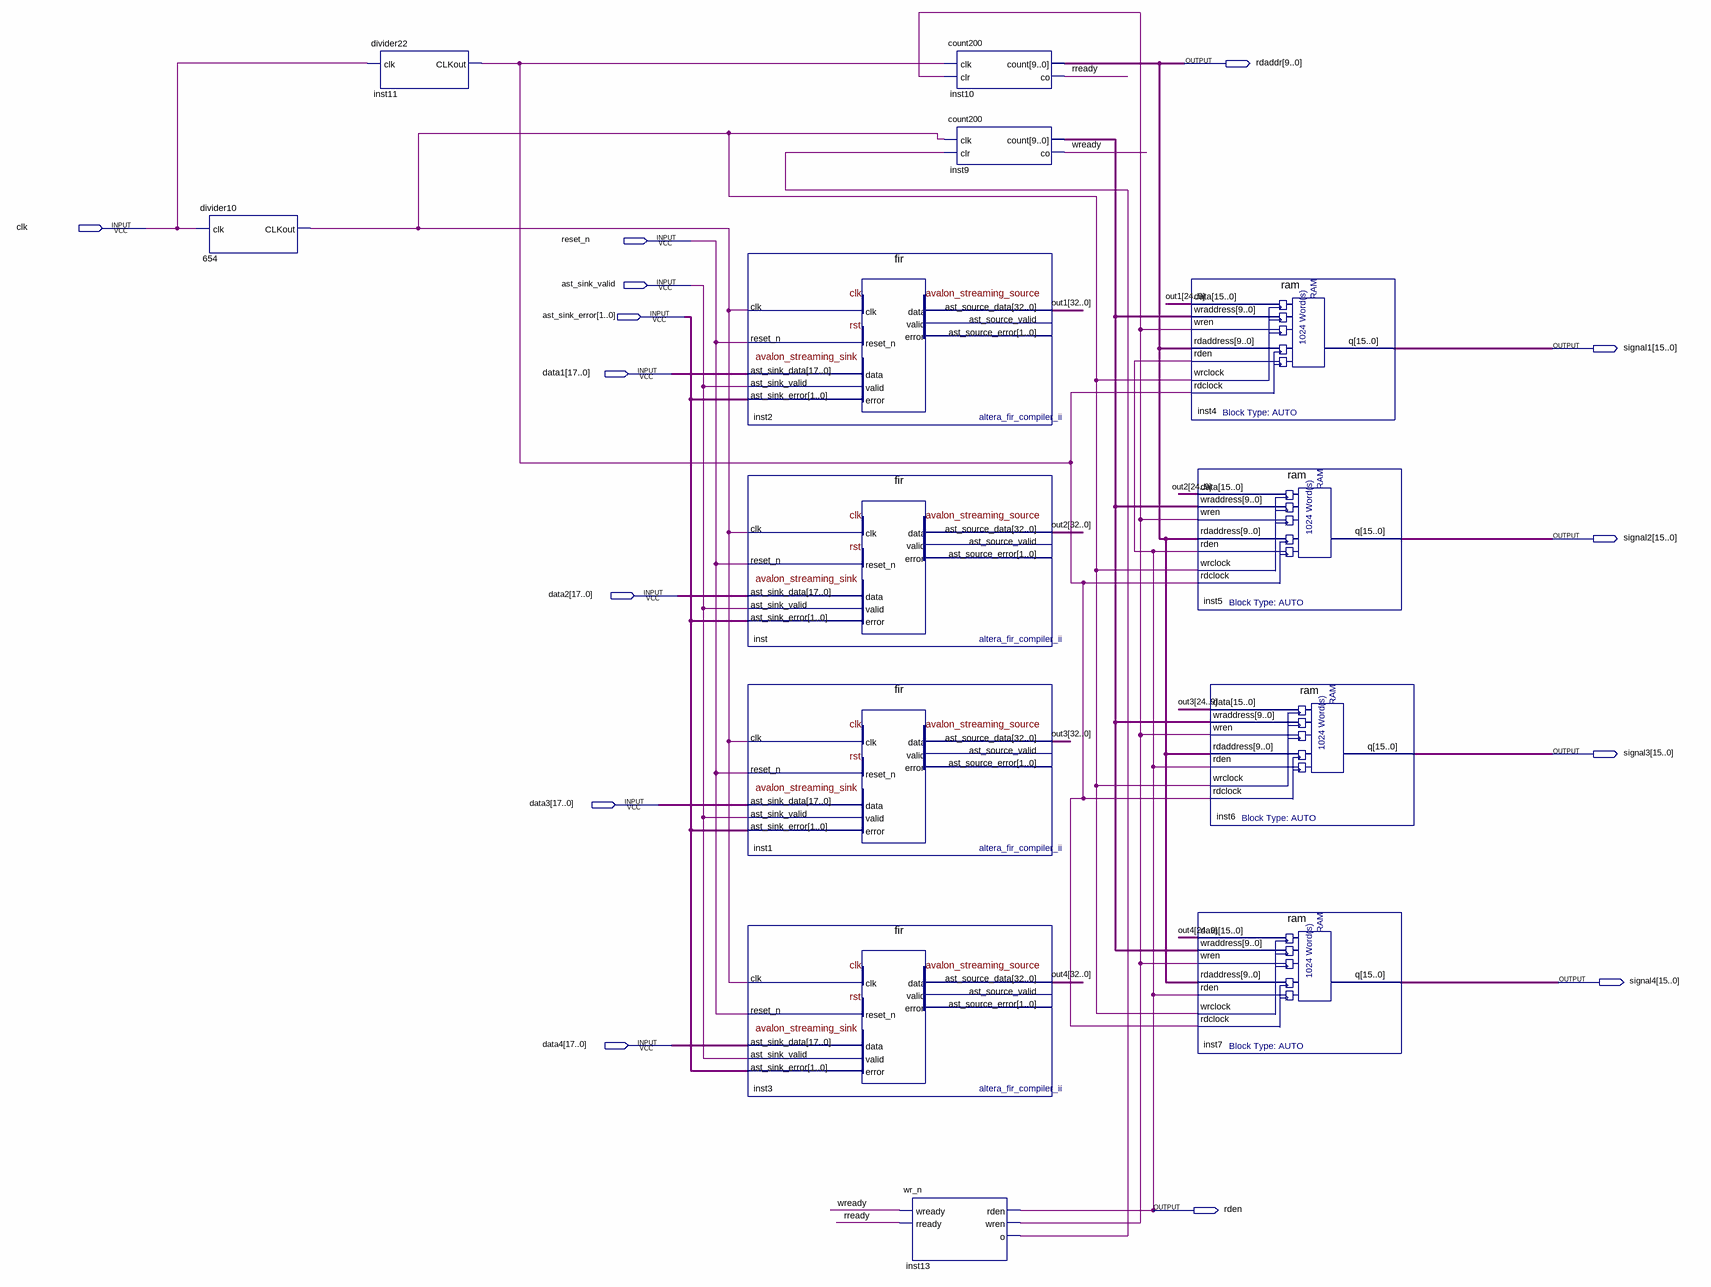
[diagram p0: schematic sheet]
// Quartus schematic dataa_b.bdf as structural Verilog: 13 symbols, 14 pins
module dataa_b (
  input  clk,
  input  reset_n,
  input  ast_sink_valid,
  input  [1:0] ast_sink_error,
  input  [17:0] data1,
  input  [17:0] data2,
  input  [17:0] data3,
  input  [17:0] data4,
  output [9:0] rdaddr,
  output [15:0] signal1,
  output [15:0] signal2,
  output [15:0] signal3,
  output [15:0] signal4,
  output rden
);

  wire inst11_clkout, inst13_o, inst13_wren, n654_clkout, rready, wready;
  wire [9:0] inst9_count;
  wire [32:0] out1, out2, out3, out4;

  divider10 u_654 (.clk(clk), .CLKout(n654_clkout));
  divider22 inst11 (.clk(clk), .CLKout(inst11_clkout));
  fir inst2 (
    .clk(n654_clkout), .reset_n(reset_n), .ast_sink_data(data1), .ast_sink_valid(ast_sink_valid),
    .ast_sink_error(ast_sink_error), .ast_source_data(out1));  // open: ast_source_valid, ast_source_error
  fir inst (
    .clk(n654_clkout), .reset_n(reset_n), .ast_sink_data(data2), .ast_sink_valid(ast_sink_valid),
    .ast_sink_error(ast_sink_error), .ast_source_data(out2));  // open: ast_source_valid, ast_source_error
  fir inst1 (
    .clk(n654_clkout), .reset_n(reset_n), .ast_sink_data(data3), .ast_sink_valid(ast_sink_valid),
    .ast_sink_error(ast_sink_error), .ast_source_data(out3));  // open: ast_source_valid, ast_source_error
  fir inst3 (
    .clk(n654_clkout), .reset_n(reset_n), .ast_sink_data(data4), .ast_sink_valid(ast_sink_valid),
    .ast_sink_error(ast_sink_error), .ast_source_data(out4));  // open: ast_source_valid, ast_source_error
  wr_n inst13 (.wready(wready), .rready(rready), .rden(rden), .wren(inst13_wren), .o(inst13_o));
  count200 inst10 (.clk(inst11_clkout), .clr(inst13_wren), .count(rdaddr), .co(rready));
  count200 inst9 (.clk(n654_clkout), .clr(inst13_o), .count(inst9_count), .co(wready));
  ram inst4 (
    .data(out1[24:9]), .wraddress(inst9_count), .wren(inst13_wren), .rdaddress(rdaddr), .rden(rden),
    .wrclock(n654_clkout), .rdclock(inst11_clkout), .q(signal1));
  ram inst5 (
    .data(out2[24:9]), .wraddress(inst9_count), .wren(inst13_wren), .rdaddress(rdaddr), .rden(rden),
    .wrclock(n654_clkout), .rdclock(inst11_clkout), .q(signal2));
  ram inst6 (
    .data(out3[24:9]), .wraddress(inst9_count), .wren(inst13_wren), .rdaddress(rdaddr), .rden(rden),
    .wrclock(n654_clkout), .rdclock(inst11_clkout), .q(signal3));
  ram inst7 (
    .data(out4[24:9]), .wraddress(inst9_count), .wren(inst13_wren), .rdaddress(rdaddr), .rden(rden),
    .wrclock(n654_clkout), .rdclock(inst11_clkout), .q(signal4));
endmodule
